# Altium schematic sheet intelGalileoIdcAdapter.SchDoc: DE:TMP:11:UC:EXPANDIDO
size 137 x 101 mm; Date: 21-07-2022; SheetNumber: 1; SheetTotal: 1; WebFGR: www.abebashop.com; VersionFGR: 20220721; PageSetup: Record=PageOptions|CenterHorizontal=True|CenterVertical=True|PrintScale=2.00|XCorrection=1.00|YCorrection=1.00|PrintKind=0|BorderSize=5000000|LeftOffset=0|BottomOffset=0|Orientation=2|PaperLength=1000|PaperWidth=1000|Scale=100|PaperSource=7|PrintQuality=-4|MediaType=1|DitherType=10|PaperKind=Letter|PrintScaleMode=1
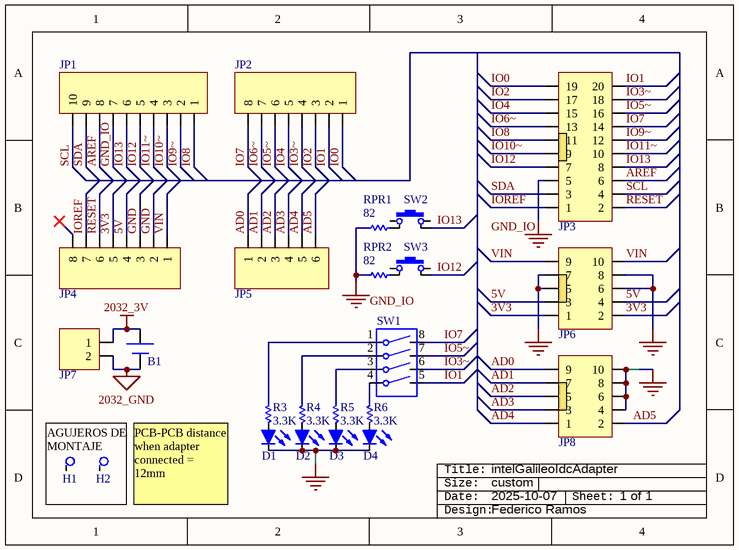
[diagram p0: intelGalileoIdcAdapter.SchDoc]

## Parts
B1  CR2032 Socket  [BAT_PP_2032_X1_HORIZ]  (value not drawn)
D1  LED  [LED_1206]  (value not drawn)
D2  LED  [LED_1206]  (value not drawn)
D3  LED  [LED_1206]  (value not drawn)
D4  LED  [LED_1206]  (value not drawn)
H1  Agujero de Montaje  [agujero]  (value not drawn)  (no BOM)
H2  Agujero de Montaje  [agujero]  (value not drawn)  (no BOM)
JP1  Header10x1  [HDR10x1]  (value not drawn)
JP2  Header8x1  [HDR8x1]  (value not drawn)
JP3  IDC 10x2 90deg  [idc10x2_90]  (value not drawn)
JP4  Header8x1  [HDR8x1]  (value not drawn)
JP5  Header6x1  [HDR6x1]  (value not drawn)
JP6  IDC 5x2  [IDC5x2_90]  (value not drawn)
JP7  Header2x1  [CONPOL2x1_90]  (value not drawn)
JP8  IDC 5x2  [IDC5x2_90]  (value not drawn)
R1  Resistencia 1206; 0ohm  [R1206]  (value not drawn)
R2  Resistencia 1206; 0ohm  [R1206]  (value not drawn)
R3  value 3.3K  [R1206]  (hidden comment: Res)
R4  value 3.3K  [R1206]  (hidden comment: Res)
R5  value 3.3K  [R1206]  (hidden comment: Res)
R6  value 3.3K  [R1206]  (hidden comment: Res)
ROT?  Rotulo_empty  (value not drawn)  (graphical)
RPR1  value 82  [R1206]  (hidden comment: Res)
RPR2  value 82  [R1206]  (hidden comment: Res)
SW1  SWDIP4  [SW_DIP_04_SMD]  (value not drawn)
SW2  SW_T_5MM  [SW_T_5MM]  (value not drawn)
SW3  SW_T_5MM  [SW_T_5MM]  (value not drawn)

## Nets
2032_3V: B1.1(+) JP7.1
2032_GND: B1.2(-) JP7.2
GND: JP4.2 JP4.3 JP6.5 JP6.6 JP6.7 JP6.8 R1.1 R2.2
GND_IO: JP1.7 JP3.5 RPR1.1 RPR2.1
3V3: JP4.5 JP6.1 JP6.2
5V: JP4.4 JP6.3 JP6.4
AD0: JP5.1 JP8.9
AD1: JP5.2 JP8.7
AD2: JP5.3 JP8.5
AD3: JP5.4 JP8.3
AD4: JP5.5 JP8.1
AD5: JP5.6 JP8.2
AREF: JP1.8 JP3.6
IO0: JP2.1 JP3.19
IO1: JP2.2 JP3.20 SW1.5
IO2: JP2.3 JP3.17
IO3~: JP2.4 JP3.18 SW1.6
IO4: JP2.5 JP3.15
IO5~: JP2.6 JP3.16 SW1.7
IO6~: JP2.7 JP3.13
IO7: JP2.8 JP3.14 SW1.8
IO8: JP1.1 JP3.11
IO9~: JP1.2 JP3.12
IO10~: JP1.3 JP3.9
IO11~: JP1.4 JP3.10
IO12: JP1.5 JP3.7 SW3.1
IO13: JP1.6 JP3.8 SW2.1
IOREF: JP3.1 JP4.7
RESET: JP3.2 JP4.6
SCL: JP1.10 JP3.4
SDA: JP1.9 JP3.3
VIN: JP4.1 JP6.9 JP6.10
NetD1_1: D1.1(A) R3.1
NetD1_2: D1.2(K) D2.2(K) D3.2(K) D4.2(K) R2.1
NetD2_1: D2.1(A) R4.1
NetD3_1: D3.1(A) R5.1
NetD4_1: D4.1(A) R6.1
NetJP8_4: JP8.4 JP8.6 JP8.8 JP8.10 R1.2
NetR3_2: R3.2 SW1.1
NetR4_2: R4.2 SW1.2
NetR5_2: R5.2 SW1.3
NetR6_2: R6.2 SW1.4
NetRPR1_2: RPR1.2 SW2.2
NetRPR2_2: RPR2.2 SW3.2

Not connected (* = marked no-connect by the designer): H1 1; H2 1; JP4 8*; SW2 3 4; SW3 3 4

## Notes on the sheet
- AGUJEROS DE MONTAJE
- PCB-PCB distance when adapter connected = 12mm
- Touch switches
  CY8C9520A pull-up
  Vin = Hi-Z
  pull-up(min) = 4K
  Vin_low_max = 100mV
  Vo = 5V
  i_short-circuit = 60mA
- (near JP8) intelGalileoIdcAdapter
- custom
- 2025-10-07
- 1 of 1
- Federico Ramos
- Labels drawn without touching a wire or pin: GND_IO
- (in symbol Rotulo_empty) Title:; Size:; Date:; Sheet:; Design:

## Library data of the parts
D1-D4 = LED: Color: Green; Price: ?
JP1 = Header10x1: Header 10x1; Price: ?
JP2 JP4 = Header8x1: Header 8x1; Price: ?
JP5 = Header6x1: Header 6x1; Price: ?
JP7 = Header2x1: Header 2x1; Price: ?
R1 R2 = Resistencia 1206; 0ohm: Codigo Elemon: RS3885900; Dolares Elemon: 0.00720
R3-R6 RPR1 RPR2 = Res: Resistencia; Power: 0.25W; Price: 0.036
ROT? = Rotulo_empty: Rotulo [consolas]
SW1 = SWDIP4: Dip switch 4 contactos; Price: ?
SW2 SW3 = SW_T_5MM_1: Price: ?
JP3 = IDC 10x2 90deg: Price: ?
JP6 JP8 = IDC 5x2: Price: ?